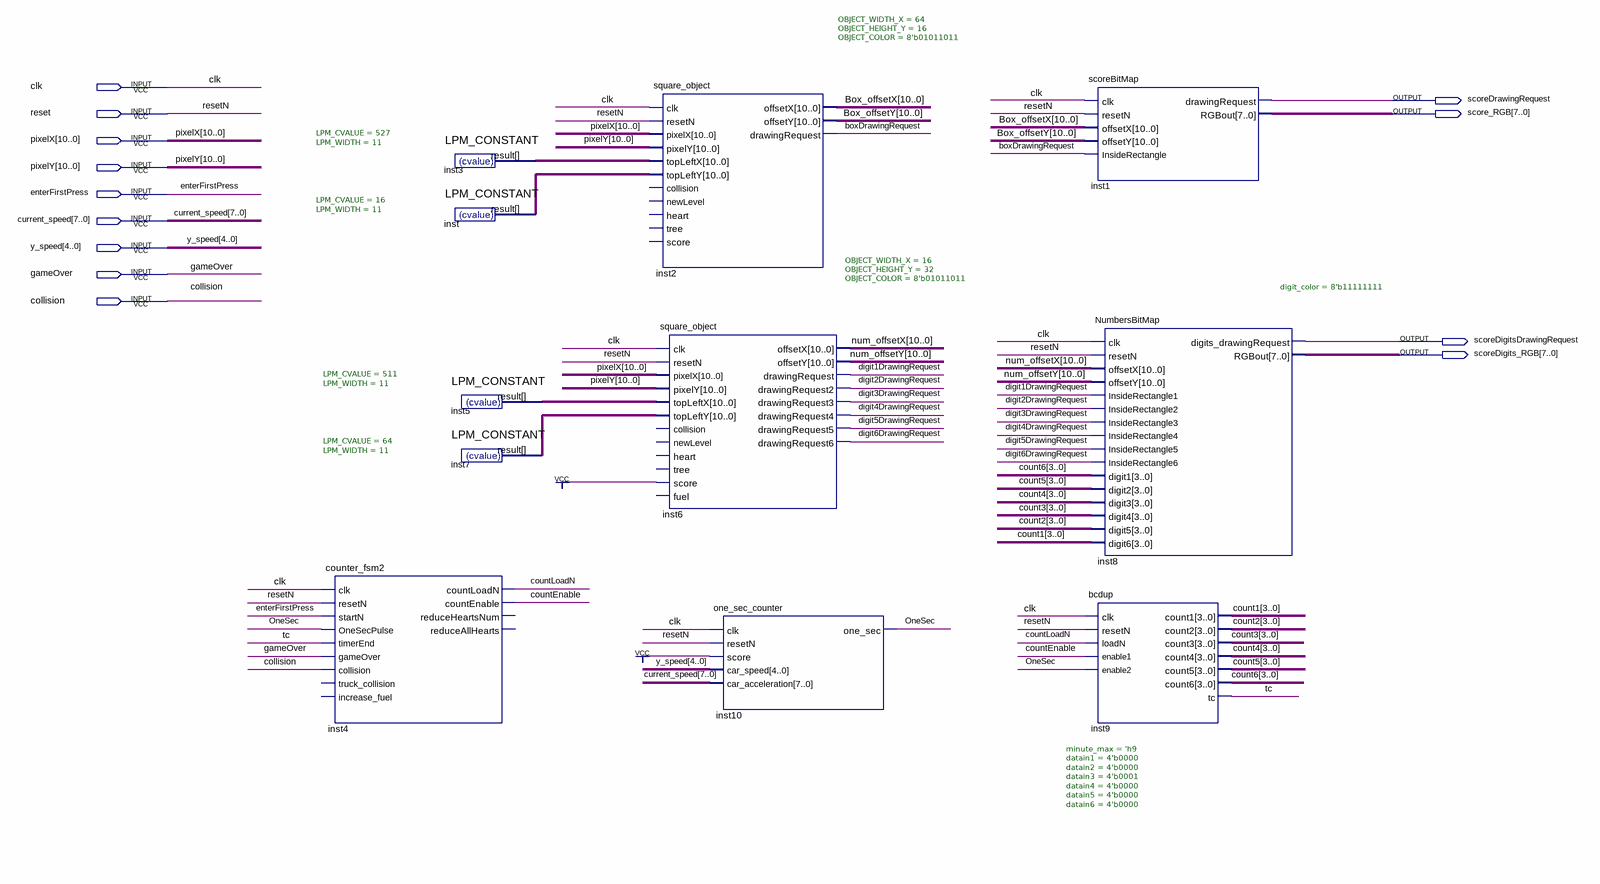
[diagram p0: schematic sheet]
// Quartus schematic Score_Block.bdf as structural Verilog: 11 symbols, 13 pins
module Score_Block (
  input  clk,
  input  reset,
  input  [10:0] pixelX,
  input  [10:0] pixelY,
  input  enterFirstPress,
  input  [7:0] current_speed,
  input  [4:0] y_speed,
  input  gameOver,
  input  collision,
  output scoreDrawingRequest,
  output [7:0] score_RGB,
  output scoreDigitsDrawingRequest,
  output [7:0] scoreDigits_RGB
);

  wire boxDrawingRequest, countEnable, countLoadN, digit1DrawingRequest, digit2DrawingRequest,
       digit3DrawingRequest, digit4DrawingRequest, digit5DrawingRequest, digit6DrawingRequest, OneSec, tc;
  wire [3:0] count1, count2, count3, count4, count5, count6;
  wire [10:0] Box_offsetX, Box_offsetY, inst3_result, inst5_result, inst7_result, inst_result, num_offsetX,
       num_offsetY;

  counter_fsm2 inst4 (
    .clk(clk), .resetN(reset), .startN(enterFirstPress), .OneSecPulse(OneSec), .timerEnd(tc),
    .gameOver(gameOver), .collision(collision), .countLoadN(countLoadN), .countEnable(countEnable));  // open: truck_collision, increase_fuel, reduceHeartsNum, reduceAllHearts
  LPM_CONSTANT #(.LPM_CVALUE(527), .LPM_WIDTH(11)) inst3 (.result(inst3_result));
  LPM_CONSTANT #(.LPM_CVALUE(16), .LPM_WIDTH(11)) inst (.result(inst_result));
  LPM_CONSTANT #(.LPM_CVALUE(511), .LPM_WIDTH(11)) inst5 (.result(inst5_result));
  LPM_CONSTANT #(.LPM_CVALUE(64), .LPM_WIDTH(11)) inst7 (.result(inst7_result));
  square_object #(.OBJECT_WIDTH_X(64), .OBJECT_HEIGHT_Y(16), .OBJECT_COLOR(8'b01011011)) inst2 (
    .clk(clk), .resetN(reset), .pixelX(pixelX), .pixelY(pixelY), .topLeftX(inst3_result),
    .topLeftY(inst_result), .offsetX(Box_offsetX), .offsetY(Box_offsetY), .drawingRequest(boxDrawingRequest));  // open: collision, newLevel, heart, tree, score
  square_object #(.OBJECT_WIDTH_X(16), .OBJECT_HEIGHT_Y(32), .OBJECT_COLOR(8'b01011011)) inst6 (
    .clk(clk), .resetN(reset), .pixelX(pixelX), .pixelY(pixelY), .topLeftX(inst5_result),
    .topLeftY(inst7_result), .score(1'b1), .offsetX(num_offsetX), .offsetY(num_offsetY),
    .drawingRequest(digit1DrawingRequest), .drawingRequest2(digit2DrawingRequest),
    .drawingRequest3(digit3DrawingRequest), .drawingRequest4(digit4DrawingRequest),
    .drawingRequest5(digit5DrawingRequest), .drawingRequest6(digit6DrawingRequest));  // open: collision, newLevel, heart, tree, fuel
  one_sec_counter inst10 (
    .clk(clk), .resetN(reset), .score(1'b1), .car_speed(y_speed), .car_acceleration(current_speed),
    .one_sec(OneSec));
  scoreBitMap inst1 (
    .clk(clk), .resetN(reset), .offsetX(Box_offsetX), .offsetY(Box_offsetY),
    .InsideRectangle(boxDrawingRequest), .drawingRequest(scoreDrawingRequest), .RGBout(score_RGB));
  NumbersBitMap #(.digit_color(8'b11111111)) inst8 (
    .clk(clk), .resetN(reset), .offsetX(num_offsetX), .offsetY(num_offsetY),
    .InsideRectangle1(digit1DrawingRequest), .InsideRectangle2(digit2DrawingRequest),
    .InsideRectangle3(digit3DrawingRequest), .InsideRectangle4(digit4DrawingRequest),
    .InsideRectangle5(digit5DrawingRequest), .InsideRectangle6(digit6DrawingRequest), .digit1(count6),
    .digit2(count5), .digit3(count4), .digit4(count3), .digit5(count2), .digit6(count1),
    .digits_drawingRequest(scoreDigitsDrawingRequest), .RGBout(scoreDigits_RGB));
  bcdup #(.minute_max('h9), .datain1(4'b0000), .datain2(4'b0000), .datain3(4'b0001), .datain4(4'b0000), .datain5(4'b0000), .datain6(4'b0000)) inst9 (
    .clk(clk), .resetN(reset), .loadN(countLoadN), .enable1(countEnable), .enable2(OneSec), .count1(count1),
    .count2(count2), .count3(count3), .count4(count4), .count5(count5), .count6(count6), .tc(tc));

  // Other names for the same wires on the sheet: resetN = reset
endmodule
